# EAGLE design FSKmodem (EAGLE 6.1)
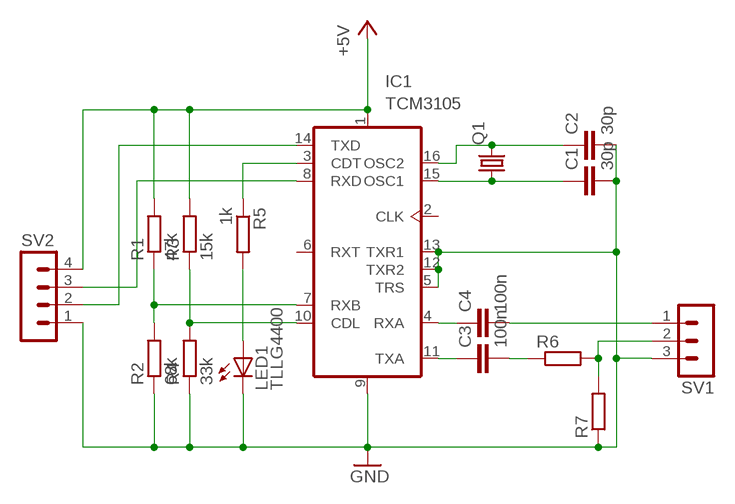
[diagram p0: schematic, sheet 1]

## Parts
C1  30p  C-EU025-024X044  [C025-024X044]
C2  30p  C-EU025-024X044  [C025-024X044]
C3  100n  C-EU025-024X044  [C025-024X044]
C4  100n  C-EU025-024X044  [C025-024X044]
IC1  TCM3105  [DIL16]
LED1  TLLG4400  [LED3MM]
Q1  CRYSTALHC49U70  [HC49U70]
R1  47k  R-EU_0204/5  [0204/5]
R2  68k  R-EU_0204/5  [0204/5]
R3  15k  R-EU_0204/5  [0204/5]
R4  33k  R-EU_0204/5  [0204/5]
R5  1k  R-EU_0204/5  [0204/5]
R6  R-EU_0204/5  [0204/5]
R7  R-EU_0204/5  [0204/5]
SV1  MA03-1  [MA03-1]
SV2  MA04-1  [MA04-1]

## Nets
+5V: IC1.1(VDD) R1.2 R3.2 SV2.4
GND: C1.2 C2.2 IC1.5(TRS) IC1.9(VSS) IC1.12(TXR2) IC1.13(TXR1) LED1.K(C) R2.1 R4.1 R7.1 SV1.3 SV2.1
N$1: C2.1 IC1.16(OSC2) Q1.2
N$2: C1.1 IC1.15(OSC1) Q1.1
N$3: C3.2 R6.1
N$4: C4.1 IC1.4(RXA)
N$5: C3.1 IC1.11(TXA)
N$6: C4.2 SV1.1
N$7: LED1.A R5.2
N$8: IC1.14(TXD) SV2.2
N$9: IC1.8(RXD) SV2.3
N$10: IC1.10(CDL) R3.1 R4.2
N$11: IC1.7(RXB) R1.1 R2.2
N$12: IC1.3(CDT) R5.1
N$13: R6.2 R7.2 SV1.2
Unconnected: IC1.2(CLK) IC1.6(RXT)

## Library data of the parts
C1-C4 = rcl:C-EU: CAPACITOR, European symbol
IC1 = tcm3105:TCM3105
LED1 = led:TLLG4400: Low Current (2mA) LED 3 mm Tinted Diffused Package color GREEN Source: Data sheet <http://www.farnell.com/datasheets/391098.pdf>; MF: VISHAY SEMICONDUCTOR; OC_FARNELL: 1612435
Q1 = crystal:CRYSTAL: CRYSTAL; OC_FARNELL: unknown; OC_NEWARK: unknown
R1-R7 = rcl:R-EU_: RESISTOR, European symbol
SV1 = con-lstb:MA03-1: PIN HEADER; OC_FARNELL: unknown; OC_NEWARK: unknown
SV2 = con-lstb:MA04-1: PIN HEADER; OC_FARNELL: unknown; OC_NEWARK: unknown

## Board
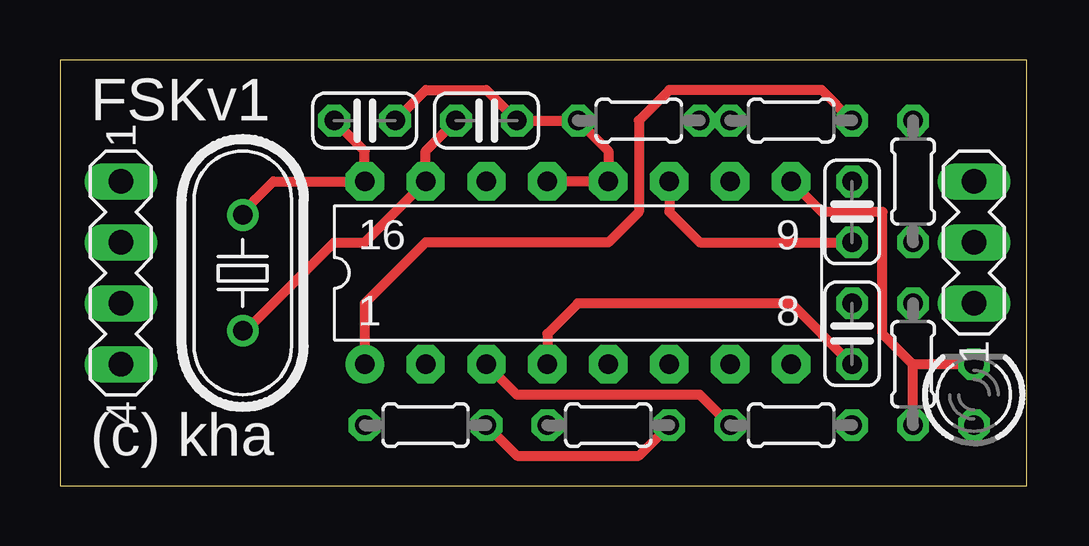
[diagram p1: board, top side]
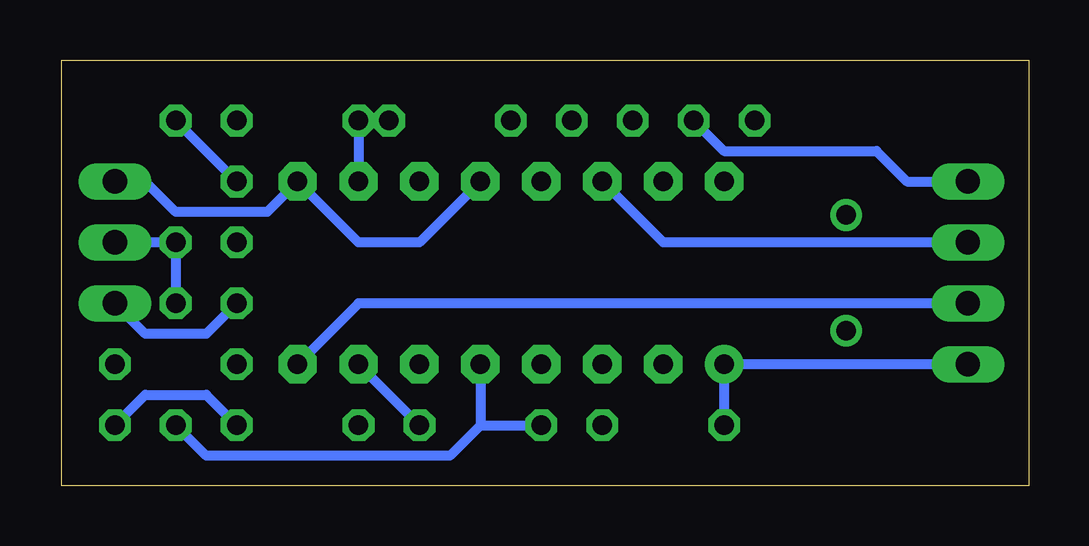
[diagram p2: board, bottom side, seen from below]

Size 40.31 x 17.77 mm. Coordinates in mm from the lower left corner, seen from the top.
Outline: 0,0 40.31,0 40.31,17.77 0,17.77 0,0
Copper layers (1*16): Top 0.035mm / dielectric 1.5mm / Bottom 0.035mm
Design rules: minimum track width 6mil, minimum drill 12mil, track to track 6mil, track to pad 6mil, pad to pad 6mil, via to via 6mil, smd to smd 0mil, copper to edge 10mil, drill to drill 10mil, minimum pad ring 10mil, minimum via ring 6mil, stop-mask expansion 2mil, vias tented up to drill 100mil, thermal gap 10mil

### Footprints (pad centres in the part's own frame; a part is rotated, then mirrored left to right if it is on the bottom)
C025-024X044 = drill 0.813 octagon: 1 -1.27,0; 2 1.27,0
DIL16 = drill 0.813 pad 1.6: 1 -8.89,-3.81 | drill 0.813 pad 1.6 octagon: 2 -6.35,-3.81; 3 -3.81,-3.81; 4 -1.27,-3.81; 5 1.27,-3.81; 6 3.81,-3.81; 7 6.35,-3.81; 8 8.89,-3.81; 9 8.89,3.81; 10 6.35,3.81; 11 3.81,3.81; 12 1.27,3.81; 13 -1.27,3.81; 14 -3.81,3.81; 15 -6.35,3.81; 16 -8.89,3.81
LED3MM = drill 0.813 octagon: A -1.27,0; K 1.27,0
HC49U70 = drill 0.813: 1 -2.413,0; 2 2.413,0
0204/5 = drill 0.813 octagon: 1 -2.54,0; 2 2.54,0
MA03-1 = drill 1.016 long: 1 -2.54,0; 2 0,0; 3 2.54,0
MA04-1 = drill 1.016 long: 1 -3.81,0; 2 -1.27,0; 3 1.27,0; 4 3.81,0

### Placement (x,y rotation side)
C1  17.78,15.24 0 top
C2  12.7,15.24 0 top
C3  33.02,11.43 90 top
C4  33.02,6.35 90 top
IC1  21.59,8.89 0 top
LED1  38.1,3.81 90 top
Q1  7.62,8.89 90 top
R1  15.24,2.54 180 top
R2  22.86,2.54 0 top
R3  30.48,15.24 0 top
R4  24.13,15.24 0 top
R5  30.48,2.54 0 top
R6  35.56,12.7 270 top
R7  35.56,5.08 90 top
SV1  38.1,10.16 90 top
SV2  2.54,8.89 270 top

### Tracks (layer width: path | path; a pad name or v marks a point on that pad's centre or on a via)
+5V
  Top 0.406: R3.2 31.75,16.51 25.4,16.51 24.13,15.24 24.13,11.43 22.86,10.16 15.24,10.16 12.7,7.62 IC1.1
  Bottom 0.406: SV2.4 IC1.1 R1.2
GND
  Top 0.406: C2.2 15.24,16.51 17.78,16.51 C1.2 R4.1 22.86,13.97 IC1.12 IC1.13 | R7.1 35.56,5.08 | 35.56,5.08 34.29,6.35 34.29,11.43 31.75,11.43 IC1.9 | LED1.K 35.56,5.08
  Bottom 0.406: IC1.12 25.4,10.16 27.94,10.16 IC1.9 31.75,11.43 35.56,11.43 36.83,12.7 SV1.3 | 22.86,2.54 R2.1 | IC1.5 22.86,2.54 | 22.86,2.54 24.13,1.27 34.29,1.27 R7.1 | C2.2 12.7,13.97 6.35,13.97 5.08,12.7 SV2.1
N$1
  Top 0.406: Q1.2 7.62,11.43 8.89,12.7 IC1.16 12.7,13.97 C2.1
N$2
  Top 0.406: Q1.1 7.75,6.48 11.43,10.16 12.7,10.16 IC1.15 15.24,13.97 C1.1
N$3
  Bottom 0.406: C3.2 R6.1
N$4
  Top 0.406: C4.1 30.48,7.62 21.59,7.62 20.32,6.35 IC1.4
N$5
  Top 0.406: IC1.11 25.4,11.43 26.67,10.16 C3.1
N$6
  Bottom 0.406: C4.2 34.29,6.35 36.83,6.35 SV1.1
N$7
  Bottom 0.406: LED1.A 36.83,3.81 34.29,3.81 R5.2
N$8
  Bottom 0.406: SV2.2 15.24,10.16 IC1.14
N$9
  Bottom 0.406: SV2.3 27.94,7.62 IC1.8
N$10
  Bottom 0.406: R4.2 R3.1 IC1.10
N$11
  Top 0.406: R1.1 19.05,1.27 24.13,1.27 R2.2
  Bottom 0.406: R2.2 IC1.7
N$12
  Top 0.406: R5.1 26.67,3.81 19.05,3.81 IC1.3
N$13
  Bottom 0.406: SV1.2 R6.2 R7.2

### Text on the board
tNames: FSKv1 | (c) kha